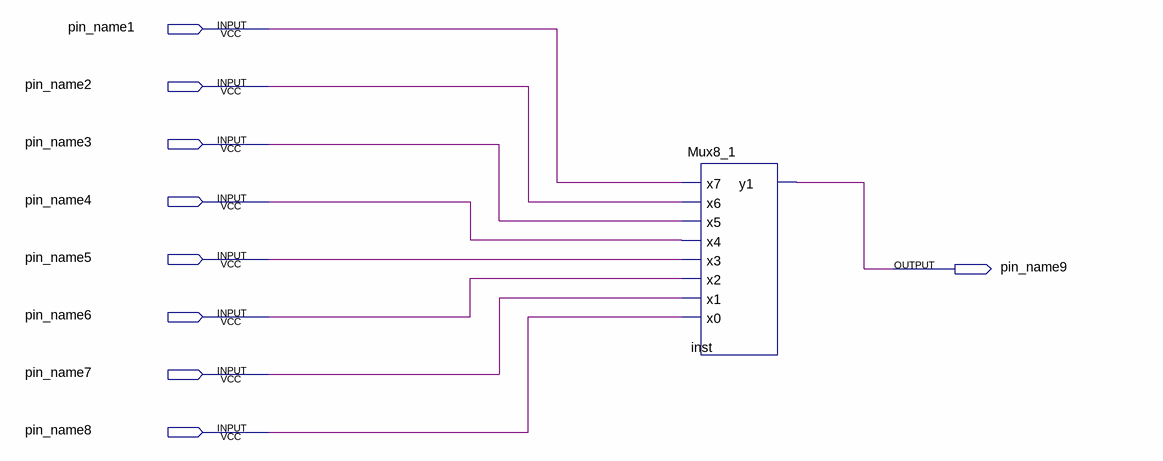
[diagram p0: schematic sheet]
// Quartus schematic MuxDemo2.bdf as structural Verilog: 1 symbols, 9 pins
module MuxDemo2 (
  input  pin_name1,
  input  pin_name2,
  input  pin_name3,
  input  pin_name4,
  input  pin_name5,
  input  pin_name6,
  input  pin_name7,
  input  pin_name8,
  output pin_name9
);

  Mux8_1 inst (
    .x7(pin_name1), .x6(pin_name2), .x5(pin_name3), .x4(pin_name4), .x3(pin_name5), .x2(pin_name6),
    .x1(pin_name7), .x0(pin_name8), .y1(pin_name9));
endmodule
